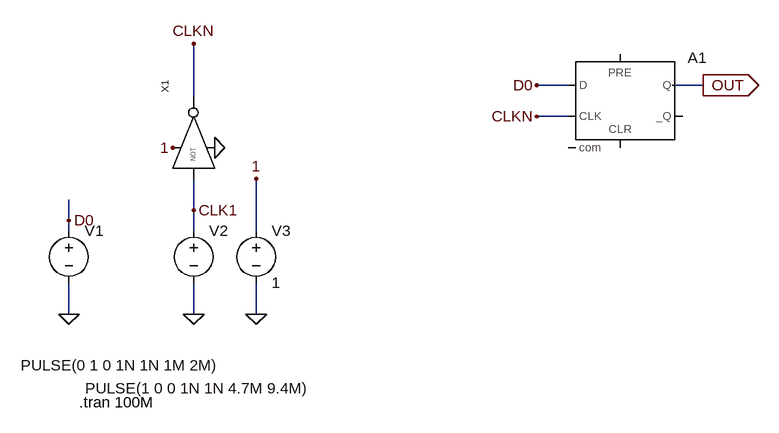
[diagram p0: schematic Draft38.asc]
Draft38.asc, the LTspice schematic file:
Version 4
SHEET 1 956 680
WIRE 640 -160 592 -160
WIRE 848 -160 800 -160
WIRE 64 -144 64 -224
WIRE 640 -112 592 -112
WIRE 64 32 64 -16
WIRE -128 48 -128 16
WIRE -128 64 -128 48
WIRE 64 64 64 32
WIRE 160 64 160 -16
WIRE -128 192 -128 144
WIRE 64 192 64 144
WIRE 160 192 160 144
FLAG -128 192 0
FLAG 64 192 0
FLAG 160 -16 1
FLAG -128 48 D0
FLAG 160 192 0
FLAG 64 32 CLK1
FLAG 592 -160 D0
FLAG 592 -112 CLKN
FLAG 848 -160 OUT
IOPIN 848 -160 Out
FLAG 96 -64 0
FLAG 32 -64 1
FLAG 64 -224 CLKN
SYMBOL voltage -128 48 R0
WINDOW 3 -74 223 Left 2
WINDOW 123 0 0 Left 0
WINDOW 39 0 0 Left 0
SYMATTR Value PULSE(0 1 0 1N 1N 1M 2M)
SYMATTR InstName V1
SYMBOL voltage 64 48 R0
WINDOW 3 -167 258 Left 2
WINDOW 123 0 0 Left 0
WINDOW 39 0 0 Left 0
SYMATTR Value PULSE(1 0 0 1N 1N 4.7M 9.4M)
SYMATTR InstName V2
SYMBOL voltage 160 48 R0
WINDOW 123 0 0 Left 0
WINDOW 39 0 0 Left 0
SYMATTR InstName V3
SYMATTR Value 1
SYMBOL Digital\\dflop 720 -208 R0
SYMATTR InstName A1
SYMBOL NOT4 80 -80 R270
SYMATTR InstName X1
TEXT -112 328 Left 2 !.tran 100M

The netlist it stands for:
* Draft38.asc
V1 D0 0 PULSE(0 1 0 1N 1N 1M 2M)
V2 CLK1 0 PULSE(1 0 0 1N 1N 4.7M 9.4M)
V3 1 0 1
A1 D0 0 CLKN 0 0 0 OUT 0 DFLOP
XX1 CLK1 1 0 CLKN NOT4  ; pins A VH VL OUT
.tran 100M
.backanno
.end

* Results of the author's LTspice run, read from the files saved beside the schematic
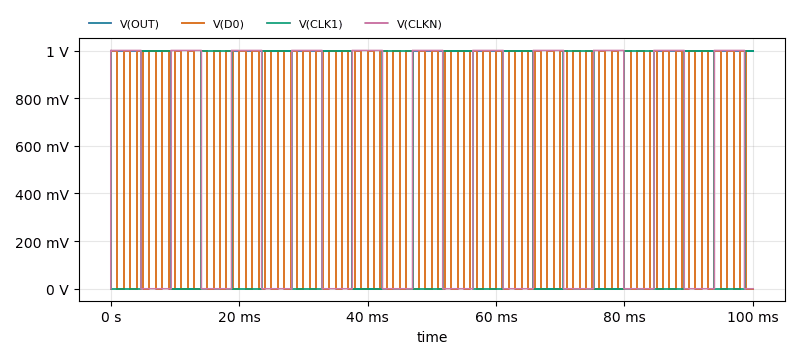
[diagram p1: Transient Analysis of Draft38.asc, plotted from the saved traces]
* Transient Analysis, 1 run:
*   V(OUT): min 0 V, max 1 V, average 624 mV, rms 789.9 mV, last 1 V
*   V(D0): min 0 V, max 1 V, average 500 mV, rms 707.1 mV, last 0 V
*   V(CLK1): min 0 V, max 1 V, average 483 mV, rms 695 mV, last 1 V
*   V(CLKN): min 0 V, max 1.001 V, average 517 mV, rms 719 mV, last 100.5 nV